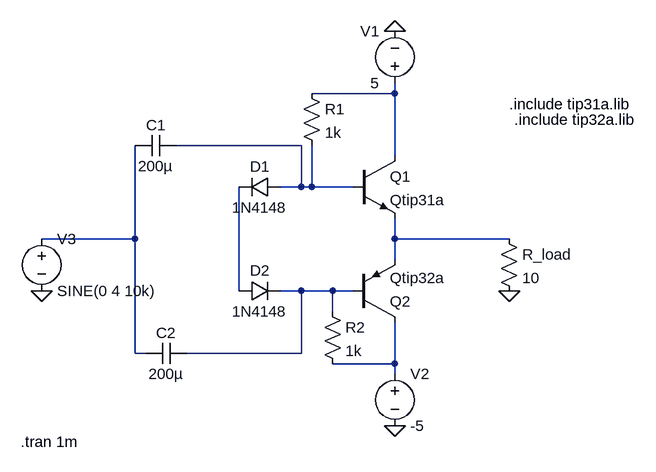
[diagram p0: schematic power_amp.asc]
power_amp.asc, the LTspice schematic file:
Version 4
SHEET 1 880 680
WIRE 176 -32 176 -48
WIRE 176 -32 48 -32
WIRE 32 48 -160 48
WIRE 176 64 176 -32
WIRE 32 112 32 48
WIRE 32 112 0 112
WIRE 48 112 48 48
WIRE 48 112 32 112
WIRE 112 112 48 112
WIRE -224 192 -224 48
WIRE -224 192 -368 192
WIRE 176 192 176 160
WIRE 352 192 176 192
WIRE 176 224 176 192
WIRE -64 272 -64 112
WIRE 32 272 0 272
WIRE 80 272 32 272
WIRE 112 272 80 272
WIRE 80 304 80 272
WIRE -224 368 -224 192
WIRE -208 368 -224 368
WIRE 32 368 32 272
WIRE 32 368 -144 368
WIRE 176 384 176 320
WIRE 176 384 80 384
WIRE 176 400 176 384
FLAG 352 272 0
FLAG 176 -128 0
FLAG 176 480 0
FLAG -368 272 0
SYMBOL npn 112 64 R0
SYMATTR InstName Q1
SYMATTR Value Qtip31a
SYMBOL pnp 112 320 M180
SYMATTR InstName Q2
SYMATTR Value Qtip32a
SYMBOL res 336 176 R0
SYMATTR InstName R_load
SYMATTR Value 10
SYMBOL voltage 176 -32 R180
WINDOW 0 24 96 Left 2
WINDOW 3 24 16 Left 2
WINDOW 123 0 0 Left 0
WINDOW 39 0 0 Left 0
SYMATTR InstName V1
SYMATTR Value 5
SYMBOL voltage 176 384 R0
WINDOW 123 0 0 Left 0
WINDOW 39 0 0 Left 0
SYMATTR InstName V2
SYMATTR Value -5
SYMBOL diode 0 96 R90
WINDOW 0 0 32 VBottom 2
WINDOW 3 32 32 VTop 2
SYMATTR InstName D1
SYMATTR Value 1N4148
SYMBOL diode -64 288 R270
WINDOW 0 32 32 VTop 2
WINDOW 3 0 32 VBottom 2
SYMATTR InstName D2
SYMATTR Value 1N4148
SYMBOL res 32 -48 R0
SYMATTR InstName R1
SYMATTR Value 1k
SYMBOL res 64 288 R0
SYMATTR InstName R2
SYMATTR Value 1k
SYMBOL cap -160 32 R90
WINDOW 0 0 32 VBottom 2
WINDOW 3 32 32 VTop 2
SYMATTR InstName C1
SYMATTR Value 200µ
SYMBOL cap -208 352 M90
WINDOW 0 0 32 VBottom 2
WINDOW 3 32 32 VTop 2
SYMATTR InstName C2
SYMATTR Value 200µ
SYMBOL voltage -368 176 R0
WINDOW 123 0 0 Left 0
WINDOW 39 0 0 Left 0
SYMATTR InstName V3
SYMATTR Value SINE(0 4 10k)
TEXT 352 -16 Left 2 !.include tip31a.lib
TEXT 360 8 Left 2 !.include tip32a.lib
TEXT -400 504 Left 2 !.tran 1m

The netlist it stands for:
* power_amp.asc
Q1 N001 N002 N004 0 Qtip31a
Q2 N007 N006 N004 0 Qtip32a
R_load N004 0 10
V1 N001 0 5
V2 N007 0 -5
D1 N002 N005 1N4148
D2 N005 N006 1N4148
R1 N001 N002 1k
R2 N006 N007 1k
C1 N002 N003 200µ
C2 N003 N006 200µ
V3 N003 0 SINE(0 4 10k)
.model D D
.lib standard.dio
.model NPN NPN
.model PNP PNP
.lib standard.bjt
.include tip31a.lib
.include tip32a.lib
.tran 1m
.backanno
.end